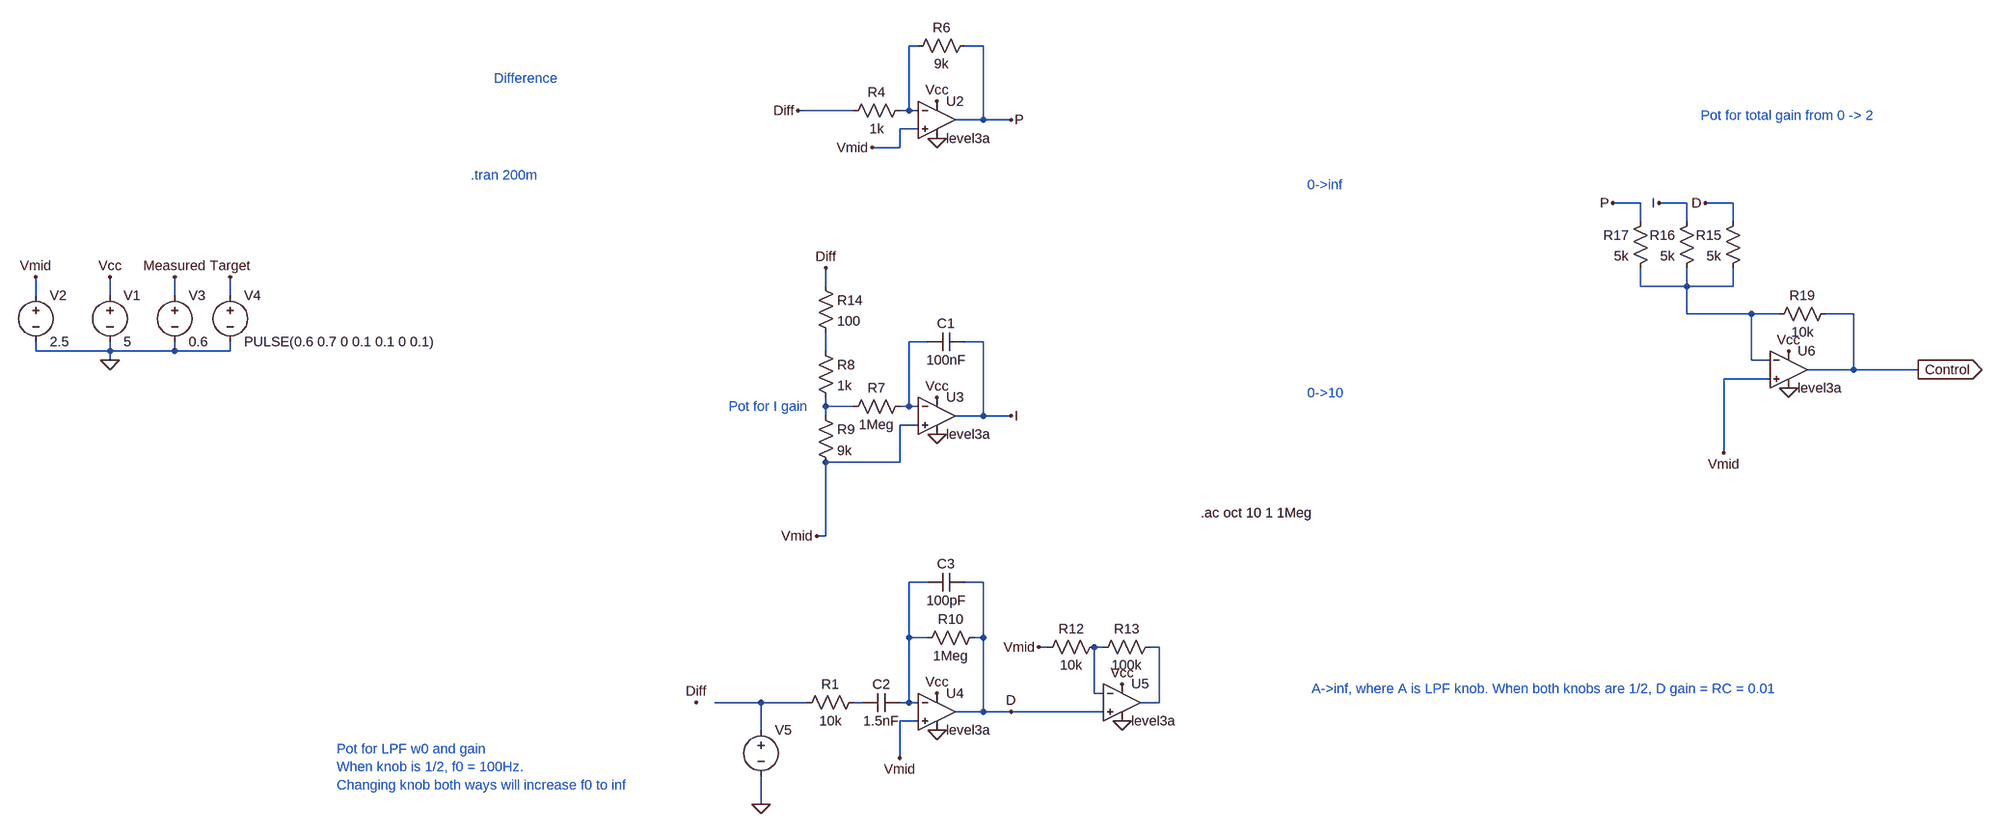
[diagram p0: schematic ltspice.asc]
ltspice.asc, the LTspice schematic file:
Version 4
SHEET 1 3324 1372
WIRE 1472 -160 1456 -160
WIRE 1584 -160 1552 -160
WIRE 1360 -48 1264 -48
WIRE 1456 -48 1456 -160
WIRE 1456 -48 1440 -48
WIRE 1472 -48 1456 -48
WIRE 1584 -32 1584 -160
WIRE 1584 -32 1536 -32
WIRE 1632 -32 1584 -32
WIRE 1472 -16 1440 -16
WIRE 1440 16 1440 -16
WIRE 1440 16 1392 16
WIRE 2720 112 2672 112
WIRE 2800 112 2752 112
WIRE 2880 112 2832 112
WIRE 2720 144 2720 112
WIRE 2800 144 2800 112
WIRE 2880 144 2880 112
WIRE 1312 256 1312 224
WIRE 2720 256 2720 224
WIRE 2800 256 2800 224
WIRE 2800 256 2720 256
WIRE 2880 256 2880 224
WIRE 2880 256 2800 256
WIRE -80 272 -80 240
WIRE 48 272 48 240
WIRE 160 272 160 240
WIRE 256 272 256 240
WIRE 2800 304 2800 256
WIRE 2912 304 2800 304
WIRE 2960 304 2912 304
WIRE 3088 304 3040 304
WIRE 1488 352 1456 352
WIRE 1584 352 1552 352
WIRE -80 368 -80 352
WIRE 48 368 48 352
WIRE 48 368 -80 368
WIRE 160 368 160 352
WIRE 160 368 48 368
WIRE 256 368 256 352
WIRE 256 368 160 368
WIRE 1312 368 1312 336
WIRE 48 384 48 368
WIRE 2912 384 2912 304
WIRE 2944 384 2912 384
WIRE 3088 400 3088 304
WIRE 3088 400 3008 400
WIRE 3200 400 3088 400
WIRE 2944 416 2864 416
WIRE 1312 464 1312 448
WIRE 1360 464 1312 464
WIRE 1456 464 1456 352
WIRE 1456 464 1440 464
WIRE 1472 464 1456 464
WIRE 1312 480 1312 464
WIRE 1584 480 1584 352
WIRE 1584 480 1536 480
WIRE 1632 480 1584 480
WIRE 1472 496 1440 496
WIRE 2864 544 2864 416
WIRE 1440 560 1440 496
WIRE 1440 560 1312 560
WIRE 1312 688 1312 560
WIRE 1312 688 1296 688
WIRE 1488 768 1456 768
WIRE 1584 768 1552 768
WIRE 1456 864 1456 768
WIRE 1488 864 1456 864
WIRE 1584 864 1584 768
WIRE 1584 864 1568 864
WIRE 1696 880 1680 880
WIRE 1792 880 1776 880
WIRE 1888 880 1872 880
WIRE 1776 960 1776 880
WIRE 1792 960 1776 960
WIRE 1200 976 1120 976
WIRE 1280 976 1200 976
WIRE 1376 976 1360 976
WIRE 1456 976 1456 864
WIRE 1456 976 1440 976
WIRE 1472 976 1456 976
WIRE 1888 976 1888 880
WIRE 1888 976 1856 976
WIRE 1584 992 1584 864
WIRE 1584 992 1536 992
WIRE 1632 992 1584 992
WIRE 1792 992 1632 992
WIRE 1472 1008 1440 1008
WIRE 1200 1024 1200 976
WIRE 1440 1072 1440 1008
WIRE 1200 1152 1200 1104
FLAG 48 384 0
FLAG 256 240 Target
FLAG 160 240 Measured
FLAG 48 240 Vcc
FLAG -80 240 Vmid
FLAG 1504 0 0
FLAG 1504 -64 Vcc
FLAG 1264 -48 Diff
FLAG 2864 544 Vmid
FLAG 1632 -32 P
FLAG 1504 512 0
FLAG 1504 448 Vcc
FLAG 1312 224 Diff
FLAG 1632 480 I
FLAG 1088 976 Diff
FLAG 1440 1072 Vmid
FLAG 1632 992 D
FLAG 1296 688 Vmid
FLAG 1504 960 Vcc
FLAG 1504 1024 0
FLAG 2976 432 0
FLAG 2976 368 Vcc
FLAG 2672 112 P
FLAG 2752 112 I
FLAG 2832 112 D
FLAG 3200 400 Control
IOPIN 3200 400 Out
FLAG 1680 880 Vmid
FLAG 1824 944 Vcc
FLAG 1824 1008 0
FLAG 1200 1152 0
FLAG 1392 16 Vmid
SYMBOL Voltage 48 256 R0
SYMATTR InstName V1
SYMATTR Value 5
SYMBOL Voltage -80 256 R0
SYMATTR InstName V2
SYMATTR Value 2.5
SYMBOL Voltage 160 256 R0
SYMATTR InstName V3
SYMATTR Value 0.6
SYMBOL Voltage 256 256 R0
SYMATTR InstName V4
SYMATTR Value PULSE(0.6 0.7 0 0.1 0.1 0 0.1)
SYMBOL OpAmps/UniversalOpAmp3 1504 -32 R0
SYMATTR InstName U2
SYMBOL Res 1456 -64 R90
WINDOW 0 0 56 VBottom 2
WINDOW 3 32 56 VTop 2
SYMATTR InstName R4
SYMATTR Value 1k
SYMBOL Res 1568 -176 R90
WINDOW 0 0 56 VBottom 2
WINDOW 3 32 56 VTop 2
SYMATTR InstName R6
SYMATTR Value 9k
SYMBOL OpAmps/UniversalOpAmp3 1504 480 R0
SYMATTR InstName U3
SYMBOL Res 1456 448 R90
WINDOW 0 0 56 VBottom 2
WINDOW 3 32 56 VTop 2
SYMATTR InstName R7
SYMATTR Value 1Meg
SYMBOL Cap 1552 336 R90
WINDOW 0 0 32 VBottom 2
WINDOW 3 32 32 VTop 2
SYMATTR InstName C1
SYMATTR Value 100nF
SYMBOL OpAmps/UniversalOpAmp3 1504 992 R0
SYMATTR InstName U4
SYMBOL Res 1584 848 R90
WINDOW 0 0 56 VBottom 2
WINDOW 3 32 56 VTop 2
SYMATTR InstName R10
SYMATTR Value 1Meg
SYMBOL Cap 1440 960 R90
WINDOW 0 0 32 VBottom 2
WINDOW 3 32 32 VTop 2
SYMATTR InstName C2
SYMATTR Value 1.5nF
SYMBOL Res 1296 352 R0
SYMATTR InstName R8
SYMATTR Value 1k
SYMBOL Res 1296 464 R0
SYMATTR InstName R9
SYMATTR Value 9k
SYMBOL OpAmps/UniversalOpAmp3 2976 400 R0
SYMATTR InstName U6
SYMBOL Res 2896 128 M0
SYMATTR InstName R15
SYMATTR Value 5k
SYMBOL Res 2816 128 M0
SYMATTR InstName R16
SYMATTR Value 5k
SYMBOL Res 2736 128 M0
SYMATTR InstName R17
SYMATTR Value 5k
SYMBOL Res 3056 288 R90
WINDOW 0 0 56 VBottom 2
WINDOW 3 32 56 VTop 2
SYMATTR InstName R19
SYMATTR Value 10k
SYMBOL OpAmps/UniversalOpAmp3 1824 976 R0
SYMATTR InstName U5
SYMBOL Res 1792 864 R90
WINDOW 0 0 56 VBottom 2
WINDOW 3 32 56 VTop 2
SYMATTR InstName R12
SYMATTR Value 10k
SYMBOL Res 1888 864 R90
WINDOW 0 0 56 VBottom 2
WINDOW 3 32 56 VTop 2
SYMATTR InstName R13
SYMATTR Value 100k
SYMBOL Voltage 1200 1008 R0
SYMATTR InstName V5
SYMATTR Value ""
SYMATTR Value2 AC 1
SYMBOL Res 1296 240 R0
SYMATTR InstName R14
SYMATTR Value 100
SYMBOL Cap 1552 752 R90
WINDOW 0 0 32 VBottom 2
WINDOW 3 32 32 VTop 2
SYMATTR InstName C3
SYMATTR Value 100pF
SYMBOL Res 1376 960 R90
WINDOW 0 0 56 VBottom 2
WINDOW 3 32 56 VTop 2
SYMATTR InstName R1
SYMATTR Value 10k
TEXT 672 64 Left 2 ;.tran 200m
TEXT 712 -104 Left 2 ;Difference
TEXT 440 1056 Left 2 ;Pot for LPF w0 and gain\nWhen knob is 1/2, f0 = 100Hz. \nChanging knob both ways will increase f0 to inf
TEXT 2144 80 Left 2 ;0->inf
TEXT 2144 440 Left 2 ;0->10
TEXT 2152 952 Left 2 ;A->inf, where A is LPF knob. When both knobs are 1/2, D gain = RC = 0.01
TEXT 2824 -40 Left 2 ;Pot for total gain from 0 -> 2
TEXT 1144 464 Left 2 ;Pot for I gain
TEXT 1960 648 Left 2 !.ac oct 10 1 1Meg

The netlist it stands for:
* ltspice.asc
V1 Vcc 0 5
V2 Vmid 0 2.5
V3 Measured 0 0.6
V4 Target 0 PULSE(0.6 0.7 0 0.1 0.1 0 0.1)
XU2 Vmid N001 Vcc 0 P level3a  ; pins In+ In- V+ V- OUT
R4 N001 Diff 1k
R6 P N001 9k
XU3 Vmid N003 Vcc 0 I level3a  ; pins In+ In- V+ V- OUT
R7 N003 N005 1Meg
C1 I N003 100nF
XU4 Vmid N006 Vcc 0 D level3a  ; pins In+ In- V+ V- OUT
R10 D N006 1Meg
C2 N006 N010 1.5nF
R8 N004 N005 1k
R9 N005 Vmid 9k
XU6 Vmid N002 Vcc 0 Control level3a  ; pins In+ In- V+ V- OUT
R15 D N002 5k
R16 I N002 5k
R17 P N002 5k
R19 Control N002 10k
XU5 D N007 Vcc 0 N008 level3a  ; pins In+ In- V+ V- OUT
R12 N007 Vmid 10k
R13 N008 N007 100k
V5 N009 0 AC 1
R14 Diff N004 100
C3 D N006 100pF
R1 N010 N009 10k
* .tran 200m
* Difference
* Pot for LPF w0 and gain
* When knob is 1/2, f0 = 100Hz.
* Changing knob both ways will increase f0 to inf
* 0->inf
* 0->10
* A->inf, where A is LPF knob. When both knobs are 1/2, D gain = RC = 0.01
* Pot for total gain from 0 -> 2
* Pot for I gain
.ac oct 10 1 1Meg
.backanno
.end